# EAGLE design BT management final (EAGLE 8.7.0)
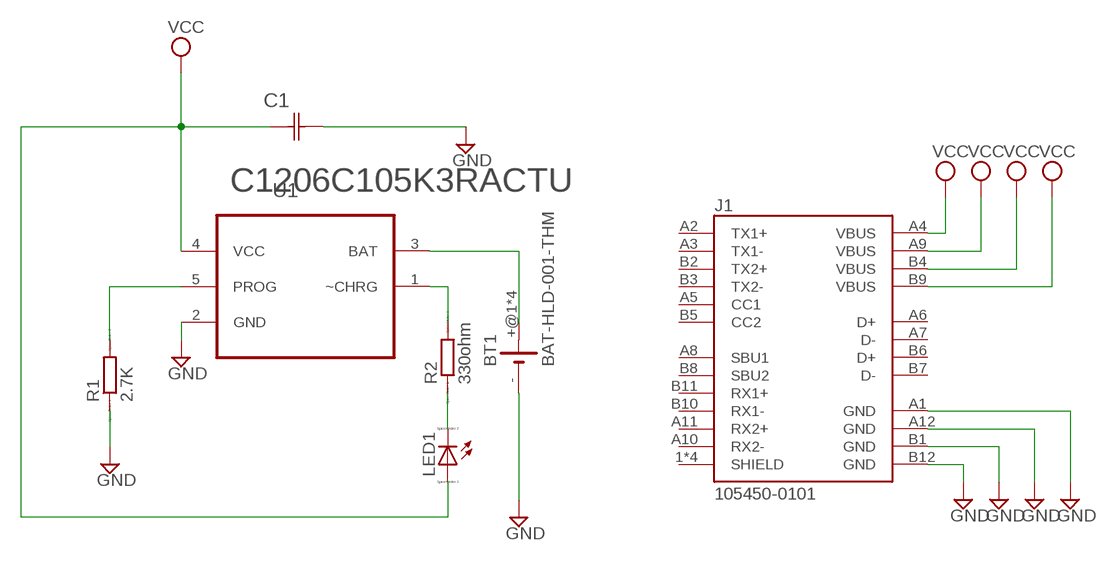
[diagram p0: schematic, sheet 1]

## Parts
BT1  BAT-HLD-001-THM  [LINX_BAT-HLD-001-THM]
C1  C1206C105K3RACTU  [CAPC3216X175N]
J1  105450-0101  [MOLEX_105450-0101]
LED1  LED_ESML0603  [LED_SML0603]
R1  2.7K  RR0603  [R0603]
R2  330ohm  RR0603  [R0603]
U1  LTC4054LES5-4.2TRPBF  [SOT95P280X100-5N]

## Nets
GND: BT1.- C1.2(C2) J1.A1(GND) J1.A12(GND) J1.B1(GND) J1.B12(GND) R1.1 U1.2(GND)
N$3: R1.2 U1.5(PROG)
N$4: R2.2 U1.1(~CHRG)
N$5: LED1.C R2.1
N$6: BT1.+@1(+) BT1.+@2(+) BT1.+@3(+) BT1.+@4(+) U1.3(BAT)
VCC: C1.1(C1) J1.A4(VBUS) J1.A9(VBUS) J1.B4(VBUS) J1.B9(VBUS) LED1.A U1.4(VCC)
Unconnected: J1.A2(TX1+) J1.A3(TX1-) J1.A5(CC1) J1.A6(D+) J1.A7(D-) J1.A8(SBU1) J1.A10(RX2-) J1.A11(RX2+) J1.B2(TX2+) J1.B3(TX2-) J1.B5(CC2) J1.B6(D+) J1.B7(D-) J1.B8(SBU2) J1.B10(RX1-) J1.B11(RX1+)

## Power pins joined to a net without a drawn wire
SHIELD: J1.1(SHIELD) J1.2(SHIELD) J1.3(SHIELD) J1.4(SHIELD)

## Library data of the parts
BT1 = BAT-HLD-001-THM:BAT-HLD-001-THM: Battery Holder CR2025/2032 Through Hole Mount; DESCRIPTION: Battery Holder CR2025/2032 Through Hole Mount; DIGI-KEY_PART_NUMBER: BAT-HLD-001-THM-ND; DIGI-KEY_PURCHASE_URL: https://www.digikey.in/product-detail/en/linx-technologies-inc/BAT-HLD-001-THM/BAT-HLD-001-THM-ND/3044009?WT.z_cid=ref_snapeda&utm_source=snapeda&utm_medium=aggregator&utm_campaign=buynow; MF: Linx; MP: BAT-HLD-001-THM; PACKAGE: None
C1 = C1206C105K3RACTU:C1206C105K3RACTU: CAPACITOR, 1206; AVAILABILITY: Good; DESCRIPTION: Capacitor; Ceramic; Cap; 1.00uF; Tol 10%; SMT; Vol-Rtg 25V; High Cap; X7R; Tape And R; MF: Kemet; MP: C1206C105K3RACTU; PACKAGE: 1206 Kemet; PRICE: 0.08 USD
J1 = 105450-0101:105450-0101: USB Shielded I/O Receptacle; Type C; Right Angle; Surface Mount; Gold over Nickel; AVAILABILITY: Good; DESCRIPTION: USB Shielded I/O Receptacle; Type C; Right Angle; Surface Mount; Gold over Nickel; MF: Molex; MP: 105450-0101; PACKAGE: None; PRICE: 1.61 USD
LED1 = eagle-ltspice:LED_E: LED Source: http://www.osram.convergy.de Source: www.luxeon.com Source: www.kingbright.com; SPICEMODEL: NONE; SPICEPREFIX: D; SPICETYPE: diode
R1 R2 = eagle-ltspice:R: RESISTOR, European symbol; SPICEMODEL: NONE; SPICEPREFIX: R
U1 = LTC4054LES5-4.2TRPBF:LTC4054LES5-4.2TRPBF: Standalone Linear Li-Ion Battery Charger with Thermal Regulation; DESCRIPTION: LTC4054L-4.2 - 150mA Standalone Linear Li-Ion Battery Charger in ThinSOT; DIGI-KEY_PART_NUMBER: LTC4054LES5-4.2#TRPBFCT-ND; DIGI-KEY_PURCHASE_URL: https://www.digikey.in/product-detail/en/linear-technology-analog-devices/LTC4054LES5-4.2-TRPBF/LTC4054LES5-4.2-TRPBFCT-ND/1888452?WT.z_cid=ref_snapeda&utm_source=snapeda&utm_medium=aggregator&utm_campaign=buynow; MF: Linear Technology; MP: LTC4054LES5-4.2#TRPBF; PACKAGE: SOT-23-5 Linear Technology

## Board
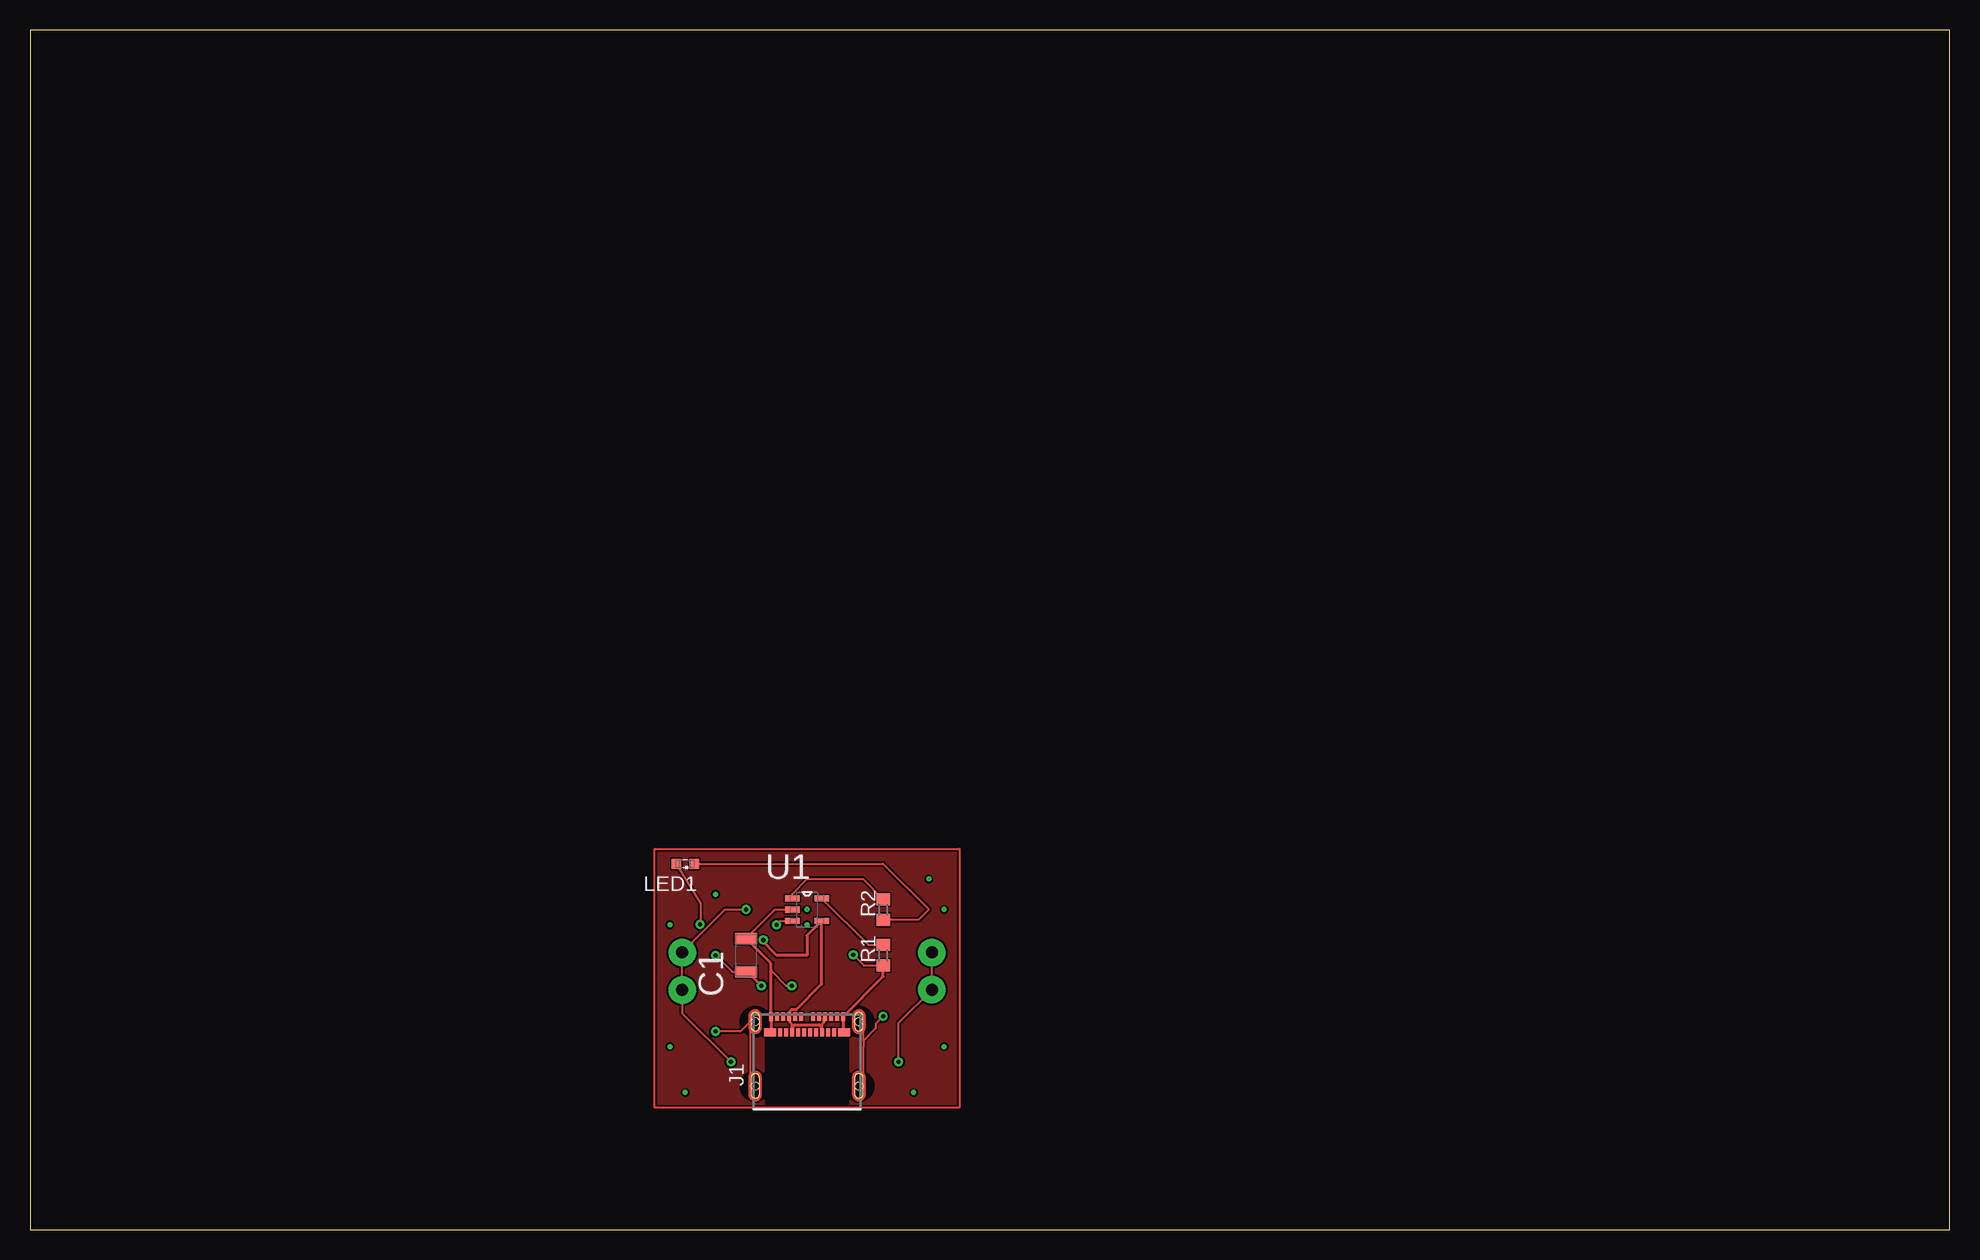
[diagram p1: board, top side]
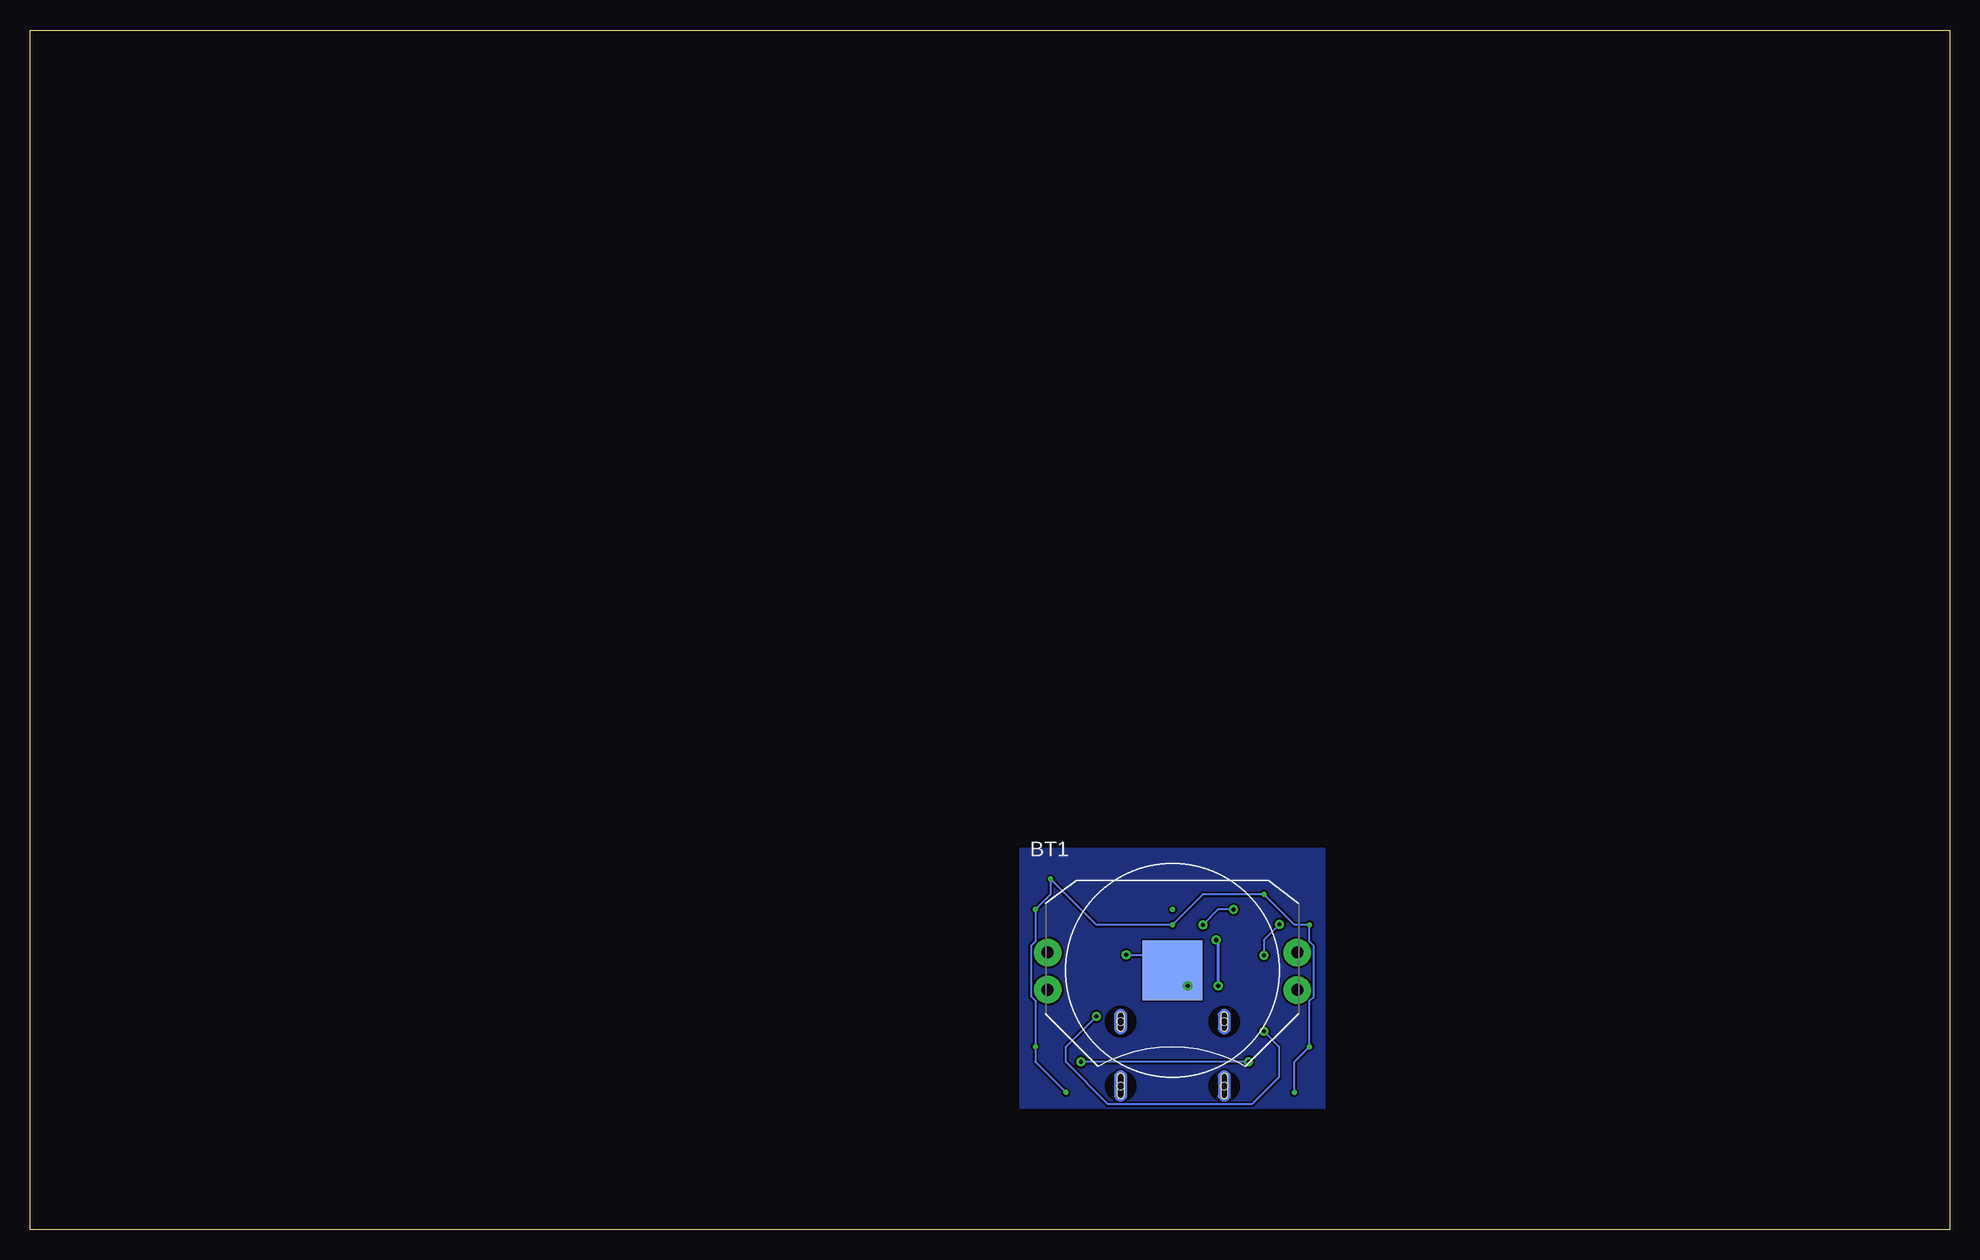
[diagram p2: board, bottom side, seen from below]

Size 160 x 100 mm. Coordinates in mm from the lower left corner, seen from the top.
Outline: 0,0 160,0 160,100 0,100 0,0
Copper layers (1*16): Top 0.035mm / dielectric 1.5mm / Bottom 0.035mm
Design rules "default": minimum track width 6mil, minimum drill 0.35mm, track to track 6mil, track to pad 6mil, pad to pad 6mil, via to via 6mil, smd to smd 6mil, copper to edge 40mil, drill to drill 6mil, minimum pad ring 10mil, minimum via ring 8mil, stop-mask expansion 4mil, vias tented up to drill 0mil, thermal gap 10mil

### Footprints (pad centres in the part's own frame; a part is rotated, then mirrored left to right if it is on the bottom)
LINX_BAT-HLD-001-THM = drill 1 pad 2.3: +@1 -10.4,1.5; +@2 -10.4,-1.6; +@3 10.4,1.5; +@4 10.4,-1.627 | smd 5 x 5: - 0,0
CAPC3216X175N = smd 0.914 x 1.803: 1 -1.397,0; 2 1.397,0
MOLEX_105450-0101 = smd 0.1 x 0.2: 1 -4.7,3.4; 2 3.9,3.4; 3 -4.7,-2; 4 4.7,-2 | smd 0.3 x 0.7: A1 -3,3.77; A2 -2.5,3.77; A3 -2,3.77; A4 -1.5,3.77; A5 -1,3.77; A6 -0.5,3.77; A7 0.5,3.77; A8 1,3.77; A9 1.5,3.77; A10 2,3.77; A11 2.5,3.77; A12 3,3.77; B2 2.25,2.47; B3 1.75,2.47; B4 1.25,2.47; B5 0.75,2.47; B6 0.25,2.47; B7 -0.25,2.47; B8 -0.75,2.47; B9 -1.25,2.47; B10 -1.75,2.47; B11 -2.25,2.47 | smd 1 x 0.7: B1 3.1,2.47; B12 -3.1,2.47 | hole 0.6: -4.32,3.36; 4.32,3.36; -4.32,-2; 4.32,-2
LED_SML0603 = smd 0.8 x 0.8: A 0.75,0; C -0.75,0
R0603 = smd 1 x 1.1: 1 -0.85,0; 2 0.85,0
SOT95P280X100-5N = smd 1.219 x 0.508: 1 -1.219,0.94; 2 -1.219,0; 3 -1.219,-0.94; 4 1.219,-0.94; 5 1.219,0.94

### Placement (x,y rotation side)
BT1  64.77,21.59 0 bottom
C1  59.69,22.86 90 top
J1  64.77,13.97 0 top
LED1  54.61,30.48 180 top
R1  71.12,22.86 90 top
R2  71.12,26.67 90 top
U1  64.77,26.67 0 top

### Tracks (layer width: path | path; a pad name or v marks a point on that pad's centre or on a via)
GND  (via drill 0.35)
  Top 0.152: 61.77,16.44 J1.B12 | 67.77,16.44 J1.B1 | C1.2 62.1,26.67 U1.2 | v68.63,22.89 69.51,22.01 R1.1 | 61.77,21.59 63.04,20.32 v63.5,20.32
  Top 0.254: 61.77,16.44 J1.A1 61.77,21.59 61.77,22.18 C1.2 | 67.77,16.44 J1.A12 71.12,21.09 R1.1
  Bottom 0.152: v68.63,22.89 68.61,22.89 68.58,22.86 66.04,22.86 BT1.- v63.5,20.32
N$1
  Top 0.152: 52.07,31.75 77.47,31.75 77.47,10.16 52.07,10.16 52.07,31.75
N$2
  pour Top: 52.07,31.75 77.47,31.75 77.47,10.16 52.07,10.16
N$3
  Top 0.152: U1.5 69.89,23.71 R1.2
N$4
  Top 0.152: U1.1 63.55,27.99 64.77,29.21 69.43,29.21 R2.2
N$5
  Top 0.152: LED1.C 71.12,30.48 74.93,26.67 74.08,25.82 R2.1
N$6  (via drill 0.35)
  Top 0.152: v58.42,13.97 54.37,18.02 BT1.+@4 BT1.+@3 57.95,26.67 v59.69,26.67 | v72.39,13.97 72.39,17.21 BT1.+@2 BT1.+@1 | v62.23,25.4 62.56,25.73 U1.3
  Bottom 0.152: v58.42,13.97 v72.39,13.97 | v59.69,26.67 60.96,26.67 v62.23,25.4
N$7
  pour Bottom: 52.07,31.75 77.47,31.75 77.47,10.16 52.07,10.16
N$8  (via drill 0.01)
  other vias: 64.77,26.67
N$9  (via drill 0.01)
  Bottom 0.152: v54.61,11.43 54.61,13.97 v53.34,15.24 53.34,19.04 52.99,19.39 52.99,23.66 53.34,24.01 v53.34,25.4 54.61,25.4 v57.15,27.94 62.23,27.94 v64.77,25.4 71.12,25.4 v74.93,29.21 74.93,27.94 v76.2,26.67 76.2,24.01 76.55,23.66 76.55,19.42 76.2,19.07 v76.2,15.24 76.2,13.97 v73.66,11.43
SHIELD  (via drill 0.35)
  Top 0.152: J1.3 J1.1 59.21,16.51 v57.15,16.51 | J1.4 69.47,15.24 69.47,15.74 | 69.47,15.74 69.47,16.57 J1.2 | v71.12,17.78 70.48,17.14 70.48,16.75 69.47,15.74
  Bottom 0.152: v57.15,16.51 55.88,15.24 55.88,12.7 58.14,10.44 70.13,10.44 73.66,13.97 73.66,15.24 v71.12,17.78
VCC  (via drill 0.35)
  Top 0.152: LED1.A 55.88,27.19 55.88,25.4 v55.85,25.43 | v57.15,22.86 58.55,21.46 C1.1
  Top 0.254: J1.A9 66.2,17.67 66.2,17.27 66.02,17.09 J1.B4 65.95,16.51 65.95,16.91 65.79,17.07 63.75,17.07 63.59,16.91 63.59,16.51 J1.B9 63.52,17.09 63.34,17.27 63.34,17.67 J1.A4 63.34,17.81 63.34,18.21 63.5,18.37 63.9,18.37 65.99,20.46 U1.4 64.77,24.51 64.77,22.86 62.23,22.86 60.96,24.13 v61.12,24.13 | v60.96,20.32 59.82,21.46 C1.1
  Bottom 0.152: v55.85,25.43 57.15,24.13 v57.15,22.86
  Bottom 0.254: v61.12,24.13 60.96,24.13 v60.96,20.32